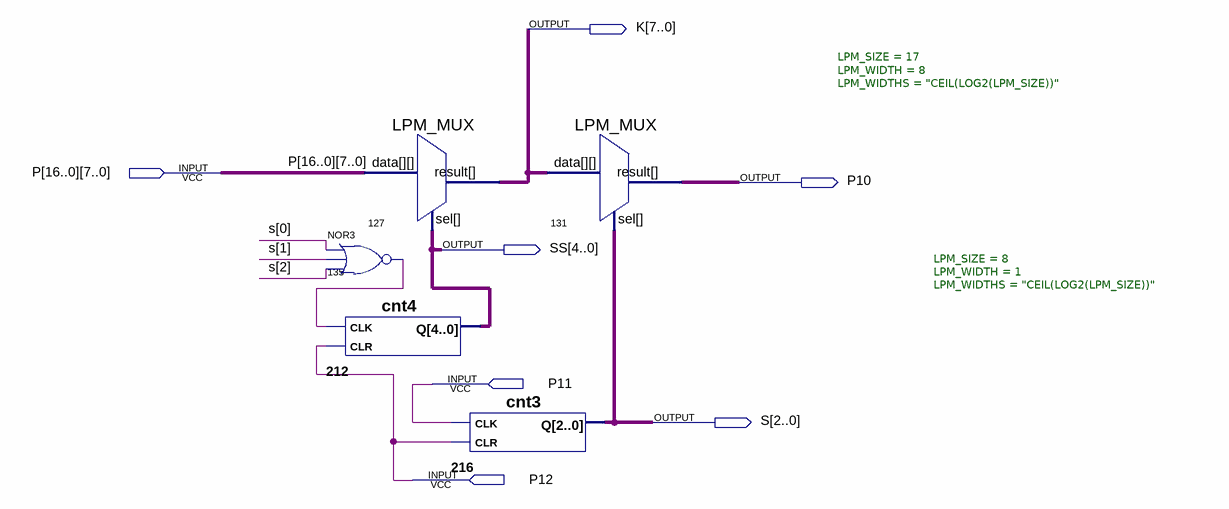
[diagram p0: schematic sheet]
// Quartus schematic dsp.bdf as structural Verilog: 5 symbols, 7 pins
module dsp (
  input  [7:0] P_16,
  input  [7:0] P_15,
  input  [7:0] P_14,
  input  [7:0] P_13,
  input  [7:0] P_12,
  input  [7:0] P_11,
  input  [7:0] P_10,
  input  [7:0] P_9,
  input  [7:0] P_8,
  input  [7:0] P_7,
  input  [7:0] P_6,
  input  [7:0] P_5,
  input  [7:0] P_4,
  input  [7:0] P_3,
  input  [7:0] P_2,
  input  [7:0] P_1,
  input  [7:0] P_0,
  input  P11,
  input  P12,
  output [7:0] K,
  output P10,
  output [4:0] SS,
  output [2:0] S
);

  wire n135_out;

  LPM_MUX #(.LPM_SIZE(17), .LPM_WIDTH(8), .LPM_WIDTHS("CEIL(LOG2(LPM_SIZE))")) u_127 (
    .data({P_16, P_15, P_14, P_13, P_12, P_11, P_10, P_9, P_8, P_7, P_6, P_5, P_4, P_3, P_2, P_1, P_0}),
    .sel(SS), .result(K));
  nor u_135 (n135_out, S[0], S[1], S[2]);
  cnt4 u_212 (.CLK(n135_out), .CLR(P12), .Q(SS));
  cnt3 u_216 (.CLK(P11), .CLR(P12), .Q(S));
  LPM_MUX #(.LPM_SIZE(8), .LPM_WIDTH(1), .LPM_WIDTHS("CEIL(LOG2(LPM_SIZE))")) u_131 (.data(K), .sel(S), .result(P10));
endmodule
